# EAGLE schematic 04-bottom (EAGLE 9.6.2)
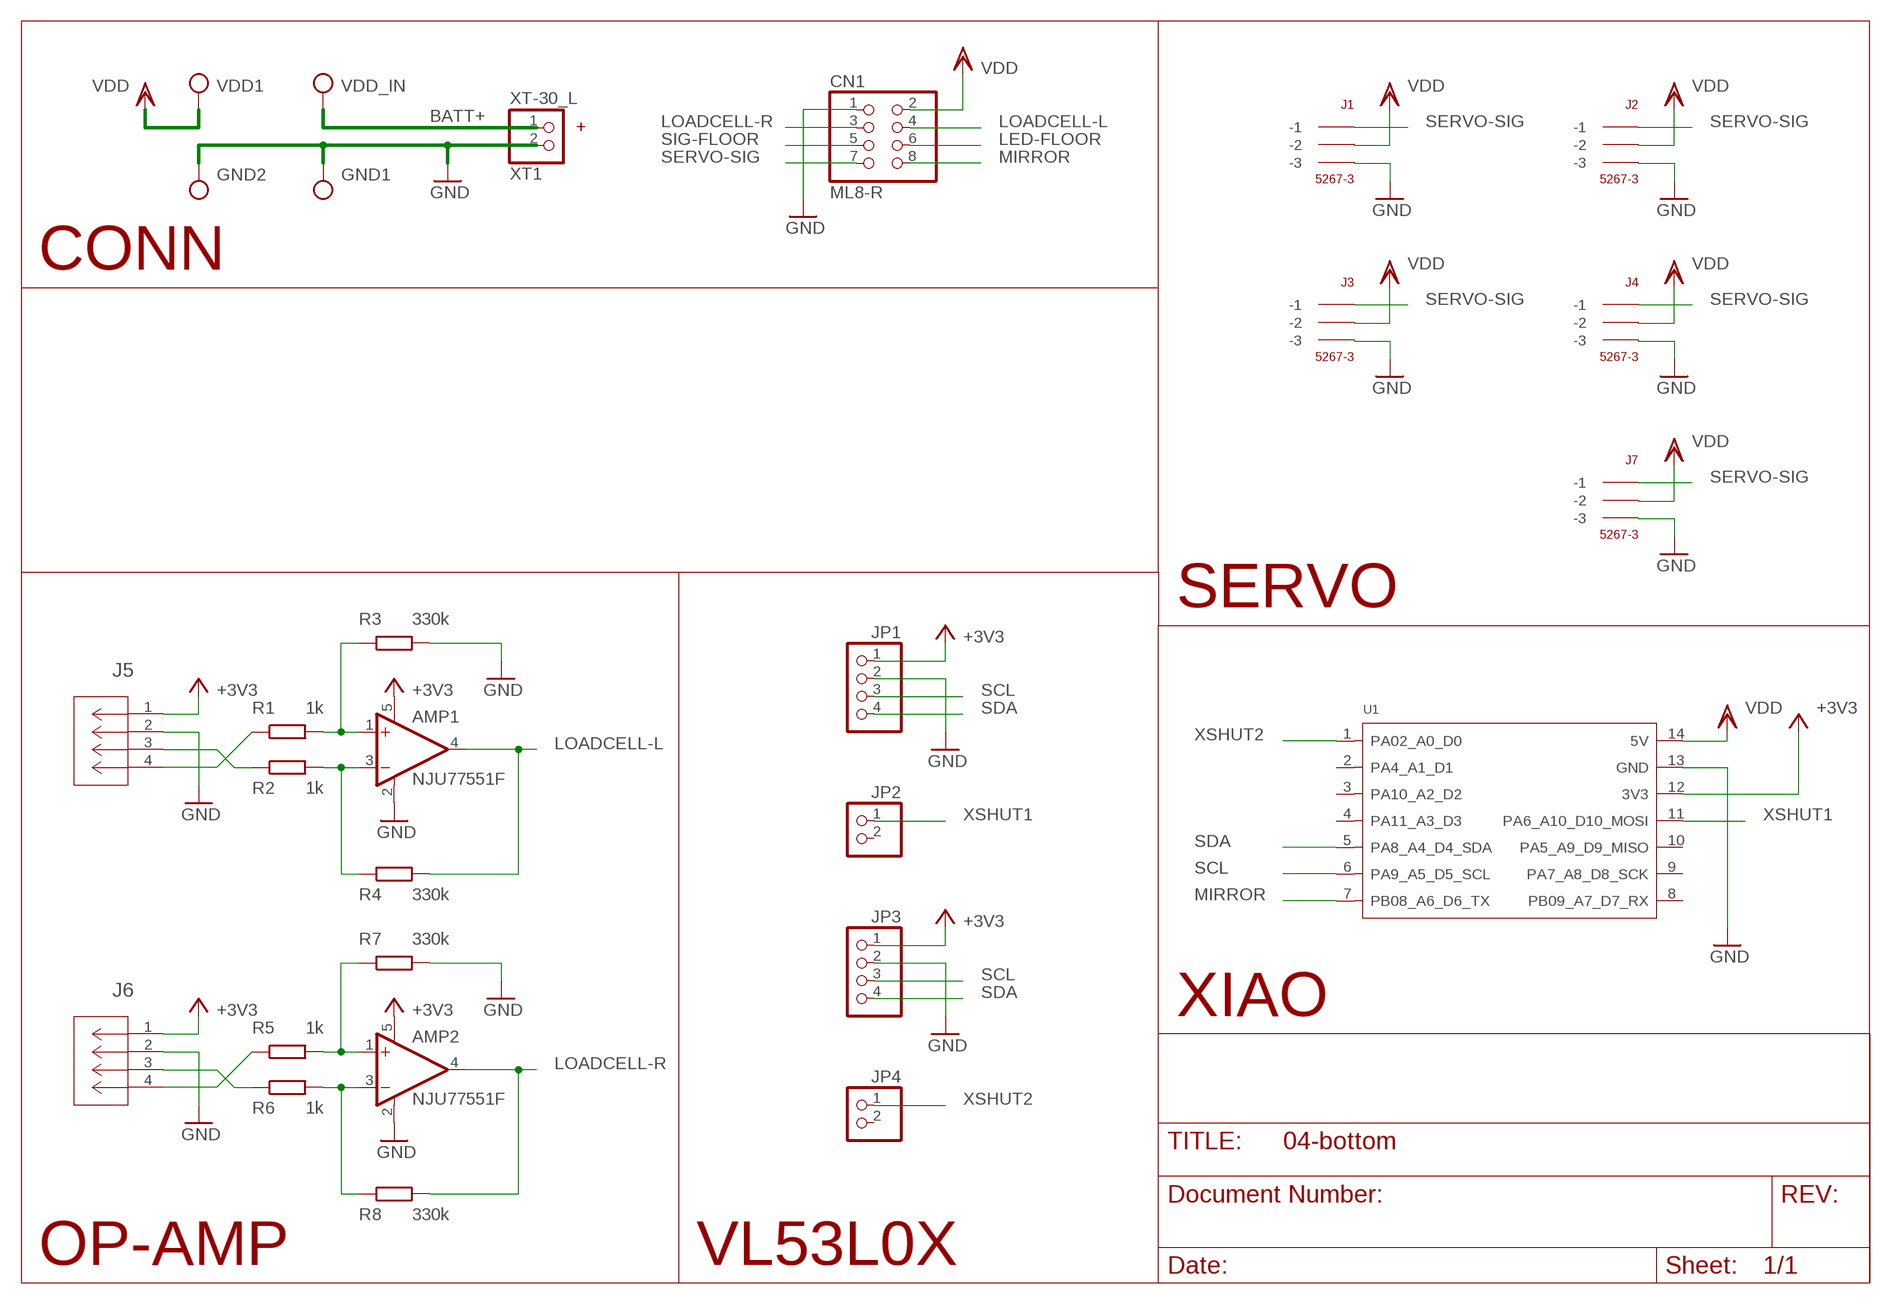
[diagram p0: schematic, sheet 1]

## Parts
AMP1  NJU77551F  [SOT23-5]
AMP2  NJU77551F  [SOT23-5]
CN1  ML8-R  [ML6]
GND1  PAD_GND  [GND]
GND2  PAD_GND  [GND]
J1  5267-3  [5267-3]
J2  5267-3  [5267-3]
J3  5267-3  [5267-3]
J4  5267-3  [5267-3]
J5  22057045  [CON_22057045_MOL]
J6  22057045  [CON_22057045_MOL]
J7  5267-3  [5267-3]
JP1  PINHD-1X4  [1X04]
JP2  PINHD-1X2  [1X02]
JP3  PINHD-1X4  [1X04]
JP4  PINHD-1X2  [1X02]
R1  1k  R-EU_R0805  [R0805]
R2  1k  R-EU_R0805  [R0805]
R3  330k  R-EU_R0805  [R0805]
R4  330k  R-EU_R0805  [R0805]
R5  1k  R-EU_R0805  [R0805]
R6  1k  R-EU_R0805  [R0805]
R7  330k  R-EU_R0805  [R0805]
R8  330k  R-EU_R0805  [R0805]
U1  MOUDLE-SEEEDUINO-XIAO  [MOUDLE14P-2.54-21X17.8MM]
VDD1  PAD_VDD  [VDD]
VDD_IN  PAD_VDD  [VDD]
XT1  XT-30_L  [XT-30_L]

## Nets
+3V3: AMP1.5(V+) AMP2.5(V+) J5.1 J6.1 JP1.1 JP3.1 U1.12(3V3)
BATT+: VDD_IN.P$1(TP) XT1.1
GND: AMP1.2(V-) AMP2.2(V-) CN1.1 GND1.P$1(TP) GND2.P$1(TP) J1.P$3(-3) J2.P$3(-3) J3.P$3(-3) J4.P$3(-3) J5.2 J6.2 J7.P$3(-3) JP1.2 JP3.2 R3.2 R7.2 U1.13(GND) XT1.2
LED-FLOOR: CN1.6
LOADCELL-L: AMP1.4(OUT) CN1.4 R4.2
LOADCELL-R: AMP2.4(OUT) CN1.3 R8.2
MIRROR: CN1.8 U1.7(PB08_A6_D6_TX)
N$1: J5.3 R2.1
N$2: J5.4 R1.1
N$3: AMP1.3(-IN) R2.2 R4.1
N$4: AMP1.1(+IN) R1.2 R3.1
N$5: J6.3 R6.1
N$6: J6.4 R5.1
N$7: AMP2.3(-IN) R6.2 R8.1
N$8: AMP2.1(+IN) R5.2 R7.1
SCL: JP1.3 JP3.3 U1.6(PA9_A5_D5_SCL)
SDA: JP1.4 JP3.4 U1.5(PA8_A4_D4_SDA)
SERVO-SIG: CN1.7 J1.P$1(-1) J2.P$1(-1) J3.P$1(-1) J4.P$1(-1) J7.P$1(-1)
SIG-FLOOR: CN1.5
VDD: CN1.2 J1.P$2(-2) J2.P$2(-2) J3.P$2(-2) J4.P$2(-2) J7.P$2(-2) U1.14(5V) VDD1.P$1(TP)
XSHUT1: JP2.1 U1.11(PA6_A10_D10_MOSI)
XSHUT2: JP4.1 U1.1(PA02_A0_D0)
Unconnected: JP2.2 JP4.2 U1.2(PA4_A1_D1) U1.3(PA10_A2_D2) U1.4(PA11_A3_D3) U1.8(PB09_A7_D7_RX) U1.9(PA7_A8_D8_SCK) U1.10(PA5_A9_D9_MISO)

## Notes on the sheet
- CONN
- SERVO
- XIAO
- OP-AMP | VL53L0X

## Library data of the parts
AMP1 AMP2 = NJU77551F:NJU77551F
CN1 = ML8:ML8-R
GND1 GND2 = M2-CONN:PAD_GND
J1-J4 J7 = con-molex-spox:5267-3
J5 J6 = con-molex-5268:22057045; COPYRIGHT: Copyright (C) 2022 Ultra Librarian. All rights reserved.; MANUFACTURER_PART_NUMBER: 22057045; MFR_NAME: Molex Connector Corporation
JP1 JP3 = pinhead:PINHD-1X4: PIN HEADER
JP2 JP4 = pinhead:PINHD-1X2: PIN HEADER
R1-R8 = rcl:R-EU_: RESISTOR, European symbol; SPICEPREFIX: R
U1 = Seeeduino XIAO:MOUDLE-SEEEDUINO-XIAO
VDD1 VDD_IN = M2-CONN:PAD_VDD
XT1 = XT-30:XT-30_L

## Net classes
0 default: width 0.508 mm